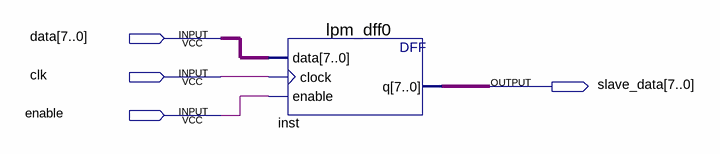
[diagram p0: schematic sheet]
// Quartus schematic slave.bdf as structural Verilog: 1 symbols, 4 pins
module slave (
  input  [7:0] data,
  input  clk,
  input  enable,
  output [7:0] slave_data
);

  lpm_dff0 inst (.data(data), .clock(clk), .enable(enable), .q(slave_data));
endmodule
